# Altium schematic sheet mipi_dsi.SchDoc
size A2
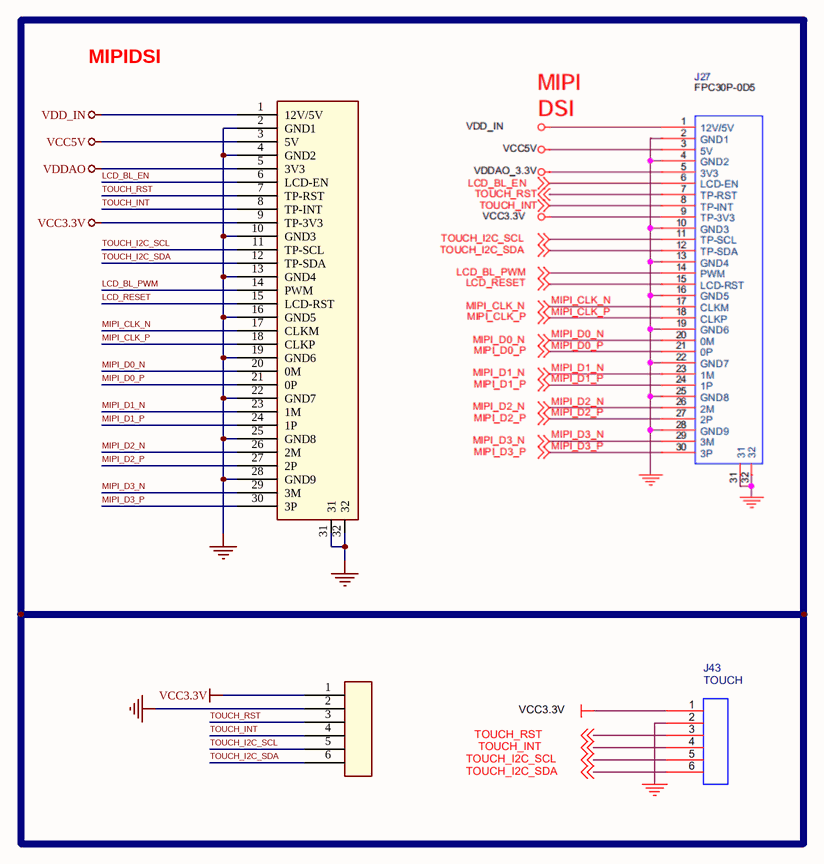
[diagram p0: mipi_dsi.SchDoc]

## Parts
J5  (no value)
J6  (no value)

## Nets
NetJ5_2: J5.2(GND1) J5.4(GND2) J5.10(GND3) J5.13(GND4) J5.16(GND5) J5.19(GND6) J5.22(GND7) J5.25(GND8) J5.28(GND9) J5.31 J5.32 J6.2
VCC3.3V: J5.9(TP-3V3) J6.1
VCC5V: J5.3(5V)
VDD_IN: J5.1(12V/5V)
VDDAO: J5.5(3V3)
LCD_BL_EN: J5.6(LCD-EN)
LCD_BL_PWM: J5.14(PWM)
LCD_RESET: J5.15(LCD-RST)
MIPI_CLK_N: J5.17(CLKM)
MIPI_CLK_P: J5.18(CLKP)
MIPI_D0_N: J5.20(0M)
MIPI_D0_P: J5.21(0P)
MIPI_D1_N: J5.23(1M)
MIPI_D1_P: J5.24(1P)
MIPI_D2_N: J5.26(2M)
MIPI_D2_P: J5.27(2P)
MIPI_D3_N: J5.29(3M)
MIPI_D3_P: J5.30(3P)
TOUCH_I2C_SCL: J5.11(TP-SCL) J6.5
TOUCH_I2C_SDA: J5.12(TP-SDA) J6.6
TOUCH_INT: J5.8(TP-INT) J6.4
TOUCH_RST: J5.7(TP-RST) J6.3

## Notes on the sheet
- MIPIDSI

## Library data of the parts
J5 = FPC30_0
J6 = CON6